# EAGLE design stamp-fixed-mk-4.2 (EAGLE 6.5.0)
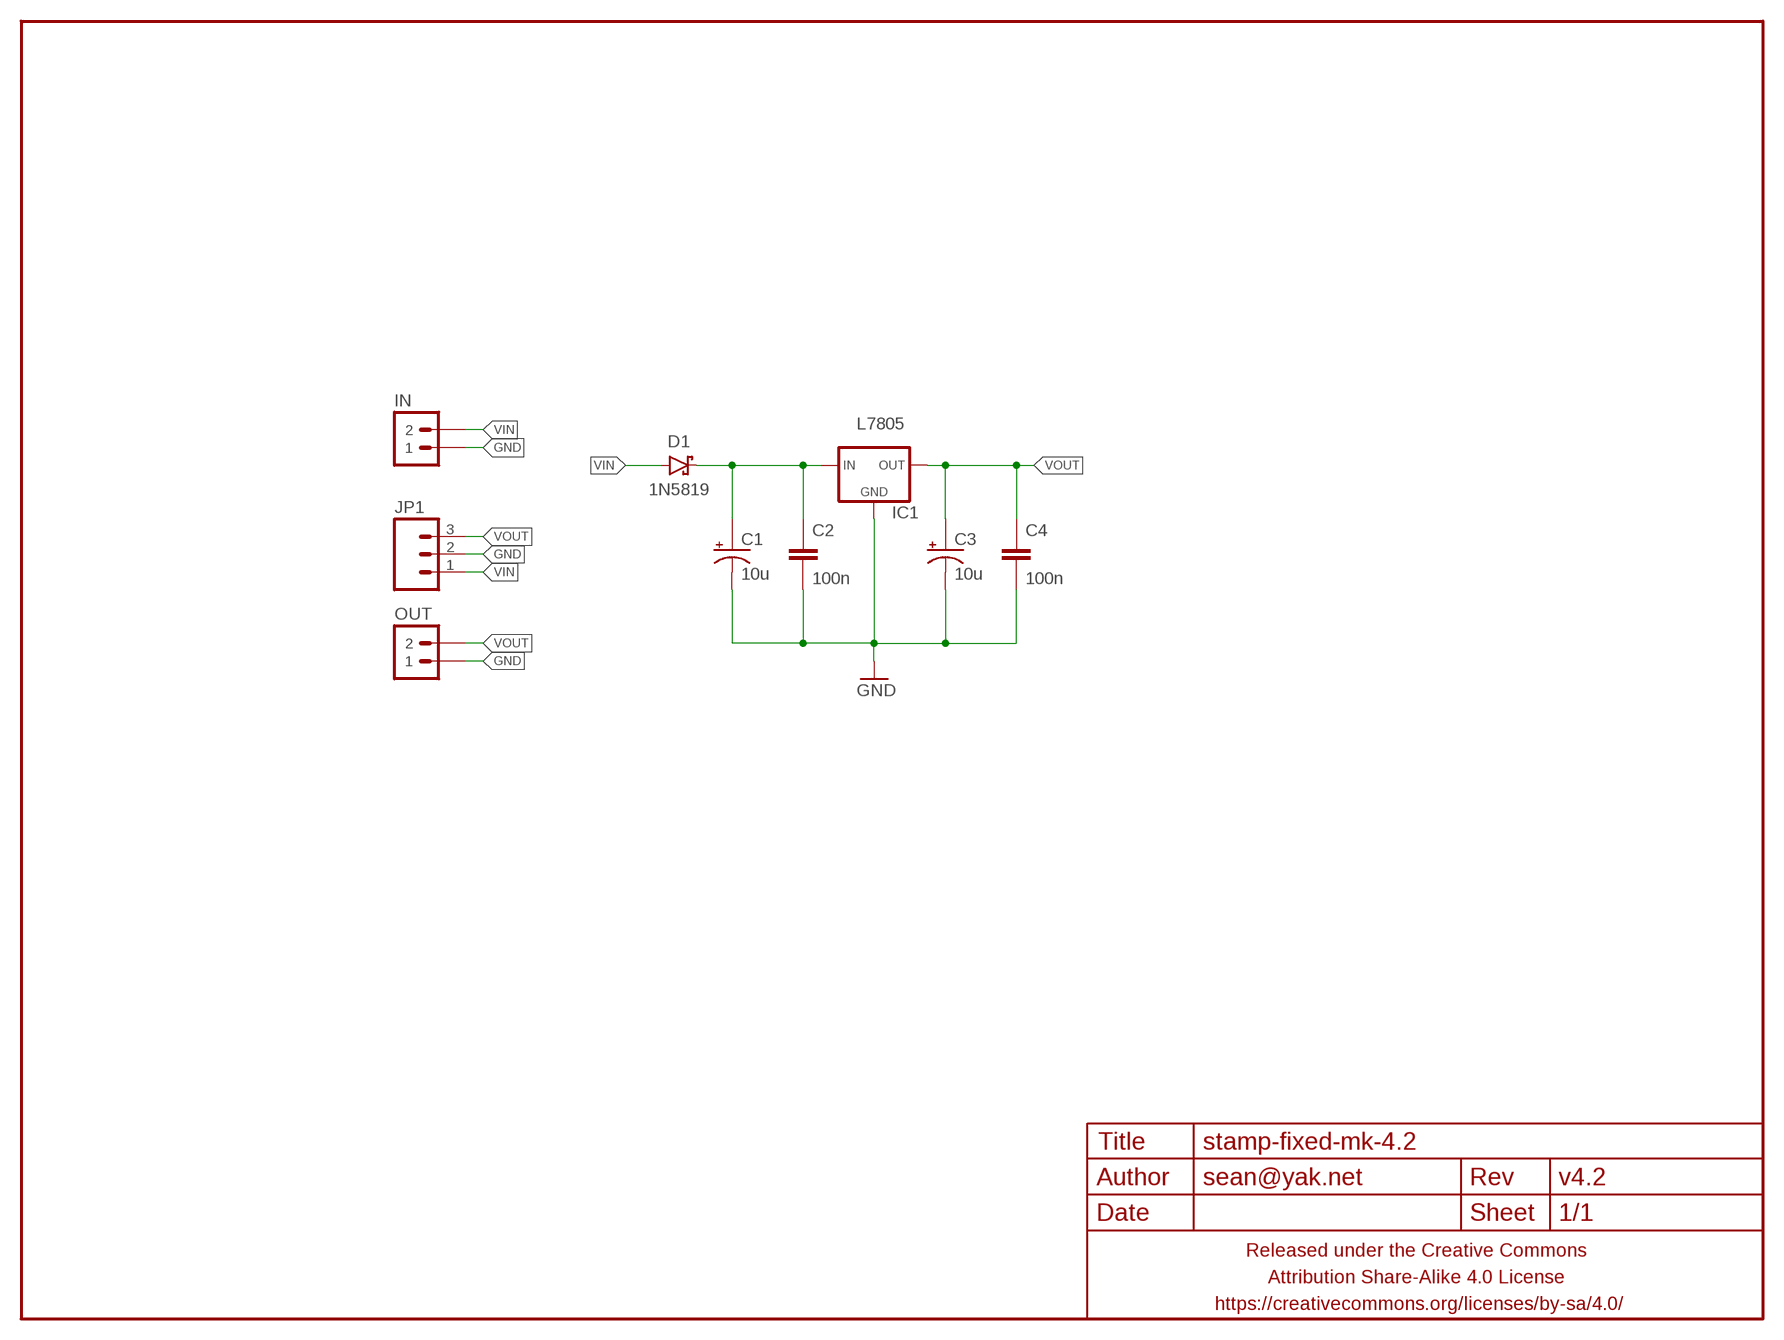
[diagram p0: schematic, sheet 1]

## Parts
C1  10u  CAPACITOR-POLARIZEDE2.5-5  [E2,5-5]
C2  100n  CAPACITOR-CERAMIC025-024X044  [C025-024X044]
C3  10u  CAPACITOR-POLARIZEDE2.5-5  [E2,5-5]
C4  100n  CAPACITOR-CERAMIC025-024X044  [C025-024X044]
D1  1N5819  DIODE-SCHOTTKYPTH-10.16MM  [DIODE-SCHOTTKY-10.16MM]
FRAME1  FRAME-LETTERNO_PACKAGE  [DUMMY]
IC1  L7805  V_REG_78XXTO-220-THERMPAD  [TO220-IGO-THERMPAD]
IN  M02PTH-CENTERED-R+  [1X02-CENTER-R+]
JP1  M03PTH-CENTERED  [1X03-CENTERED]
OUT  M02PTH-CENTERED-R+  [1X02-CENTER-R+]

## Nets
GND: C1.- C2.2 C3.- C4.2 IC1.4(GND) IC1.GND IN.1 JP1.2 OUT.1
N$2: C1.+ C2.1 D1.C IC1.IN
VIN: D1.A IN.2 JP1.1
VOUT: C3.+ C4.1 IC1.OUT JP1.3 OUT.2

## Library data of the parts
C1 C3 = A_butts:CAPACITOR-POLARIZED: POLARIZED CAPACITOR, American symbol
C2 C4 = A_butts:CAPACITOR-CERAMIC: CAPACITOR, European symbol
D1 = A_butts:DIODE-SCHOTTKY: Schottky diodes in SFE's production catalog BAT20J 1A 23V 0.62Vf RB751 120mA 40V 0.37Vf PMEG4005EJ 0.5A 40V 0.42Vf MBRA140 1A 40V 0.5Vf B340A 3A 40V SMA
FRAME1 = A_butts:FRAME-LETTER: Schematic Frame Standard 8.5x11 US Letter frame; DESIGNER: sean@yak.net; VERSION: v4.2
IC1 = A_butts:V_REG_78XX: Voltage Regulator Standard 7805 5V regulator. IGO (Input Ground Output). Spark Fun Electronics SKU : COM-00107
IN OUT = A_butts:M02: Standard 2-pin 0.1" header. Use with - straight break away headers ( PRT-00116) - right angle break away headers (PRT-00553) - swiss pins (PRT-00743) - machine pins (PRT-00117) - female headers (PRT-00115) Molex polarized connector foot print use with: PRT-08233 with associated crimp pins and housings. 2.54_SCREWTERM for use with PRT-10571. 3.5mm Screw Terminal footprints for PRT-08084 5mm Screw Terminal footprints for use with PRT-08433
JP1 = A_butts:M03: Header 3 Standard 3-pin 0.1" header. Use with straight break away headers (SKU : PRT-00116), right angle break away headers (PRT-00553), swiss pins (PRT-00743), machine pins (PRT-00117), and female headers (PRT-00115). Molex polarized connector foot print use with SKU : PRT-08232 with associated crimp pins and housings.

## Board
Postage Stamp Power Supply Small linear power supply with flexible layout.
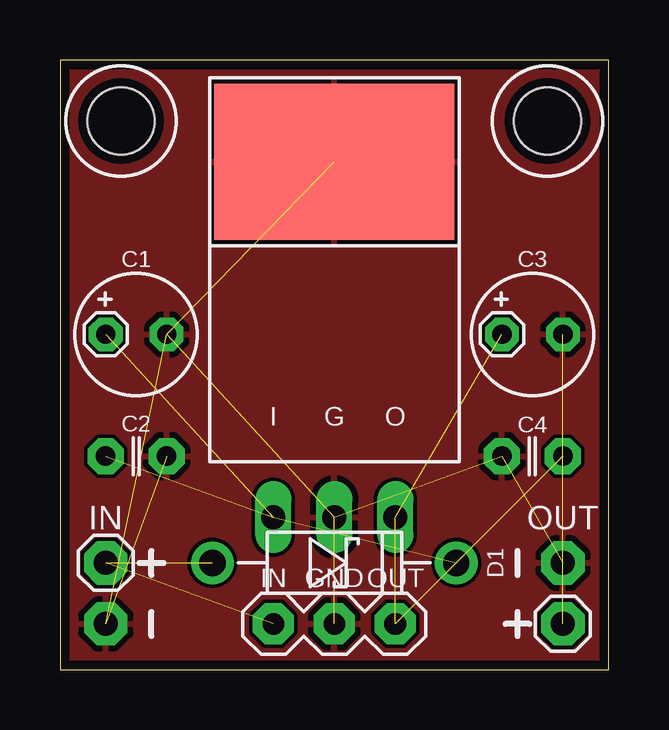
[diagram p1: board, top side]

Size 22.86 x 25.4 mm. Coordinates in mm from the lower left corner, seen from the top.
Outline: 22.86,0 22.86,25.4 0,25.4 0,0 22.86,0
Copper layers (1*16): Top 0.0356mm / dielectric 1.5011mm / Bottom 0.0356mm
Design rules "LaenPCBOrder *": minimum track width 6mil, minimum drill 13mil, track to track 6mil, track to pad 6mil, pad to pad 6mil, via to via 6mil, smd to smd 6mil, copper to edge 15mil, drill to drill 6mil, minimum pad ring 7mil, minimum via ring 7mil, stop-mask expansion 3mil, vias tented up to drill 20mil, thermal gap 10mil
Holes 2.8 mm at 2.54,22.86 20.32,22.86

### Footprints (pad centres in the part's own frame; a part is rotated, then mirrored left to right if it is on the bottom)
E2,5-5 = drill 0.8 pad 1.4 octagon: + -1.27,0; - 1.27,0
C025-024X044 = drill 0.813 pad 1.5 octagon: 1 -1.27,0; 2 1.27,0
DIODE-SCHOTTKY-10.16MM = drill 1.1 pad 1.778: A -5.08,0; C 5.08,0
TO220-IGO-THERMPAD = smd 10 x 6.5: 4 0,11 | drill 1 long: GND 0,-3.81; IN -2.54,-3.81; OUT 2.54,-3.81
1X02-CENTER-R+ = drill 1 pad 1.8 octagon: 1 -1.27,0; 2 1.27,0
1X03-CENTERED = drill 0.9 pad 1.7 octagon: 1 -2.54,0; 2 0,0; 3 2.54,0

### Placement (x,y rotation side)
C1  3.17,13.97 0 top
C2  3.17,8.89 0 top
C3  19.68,13.97 0 top
C4  19.68,8.89 180 top
D1  11.43,4.45 0 top
FRAME1  0,-0.5 0 top
IC1  11.43,10.16 0 top
IN  1.91,3.17 90 top
JP1  11.43,1.91 0 top
OUT  20.95,3.17 270 top

### Tracks (layer width: path | path; a pad name or v marks a point on that pad's centre or on a via)
GND  (8 unrouted)
  pour Top: 0,0 0,25.4 22.86,25.4 22.86,0
N$2  (3 unrouted)
VIN  (2 unrouted)
VOUT  (4 unrouted)

### Text on the board
tPlace: IN | GND | OUT